# Altium schematic sheet 08.SchDoc
size 297 x 209 mm
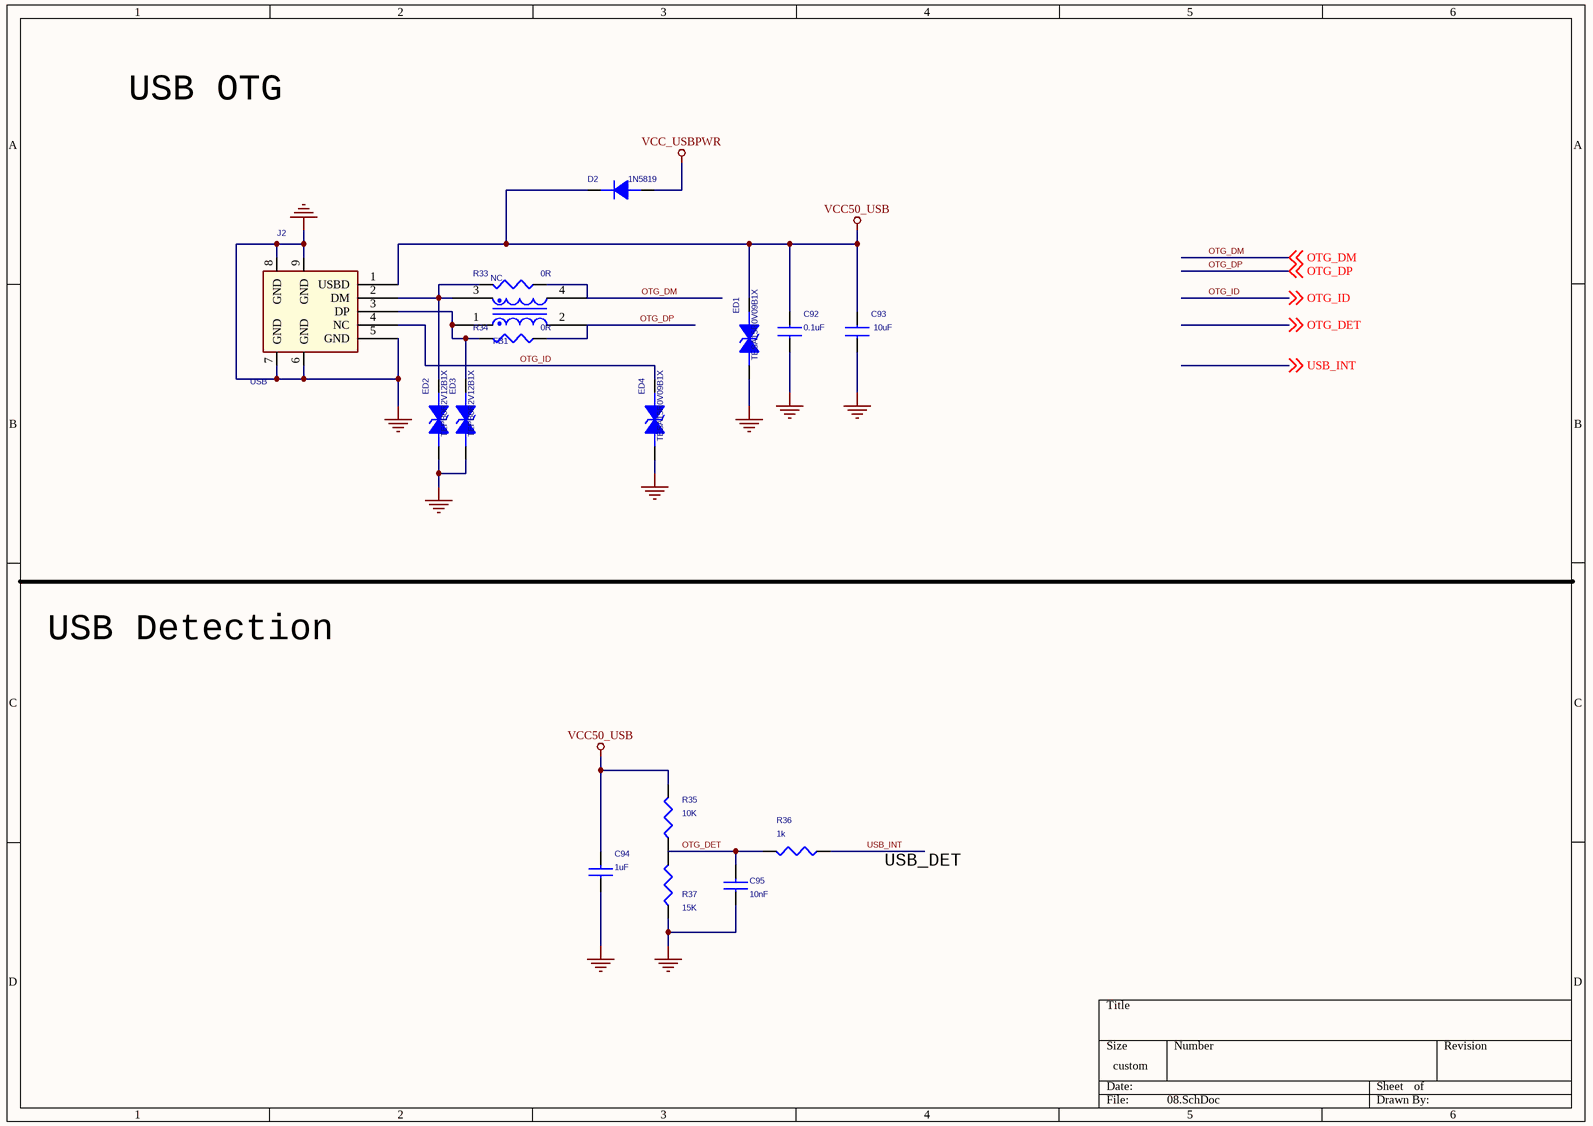
[diagram p0: 08.SchDoc]

## Parts
C92  0.1uF  [C0603]
C93  10uF  [C0603]
C94  1uF  [C0402]
C95  10nF  [C0402]
D2  1N5819  [SOD123]
ED1  TESA15R0V09B1X  [E0402N]
ED2  TEPB0R2V12B1X  [E0402N]
ED3  TEPB0R2V12B1X  [E0402N]
ED4  TESA15R0V09B1X  [E0402N]
FB1  NC  [LL-4]
J2  USB  [MICRO_USB_DIP]
R33  0R  [r0402]
R34  0R  [r0402]
R35  10K  [R0402]
R36  1k  [R0402]
R37  15K  [R0402]

## Nets
GND: C92.1 C93.2 C94.1 C95.1 ED1.2 ED2.2 ED3.2 ED4.2 J2.5(GND) J2.6(GND) J2.7(GND) J2.8(GND) J2.9(GND) R37.1
VCC50_USB: C92.2 C93.1 C94.2 D2.2(K) ED1.1 J2.1(USBD) R35.2
VCC_USBPWR: D2.1(A)
OTG_DET: C95.2 R35.1 R36.2 R37.2 ; off-sheet OTG_DET
OTG_DM: FB1.4 R33.1 ; off-sheet OTG_DM
OTG_DP: FB1.2 R34.1 ; off-sheet OTG_DP
OTG_ID: ED4.1 J2.4(NC) ; off-sheet OTG_ID
USB_INT: R36.1 ; off-sheet USB_INT
NetED2_1: ED2.1 FB1.3 J2.2(DM) R33.2
NetED3_1: ED3.1 FB1.1 J2.3(DP) R34.2

## Notes on the sheet
- USB OTG
- USB Detection
- USB_DET

## Library data of the parts
C92 = CAP NP_Dup3: 贴片电容; ROOM: USB+5V; MARK: 106
C93 = CAP NP_Dup3
C94 = CAP NP_Dup2: RoHS CHIP CAP 1uF +10/-10% X5R; MARK: 105
C95 = CAP NP_Dup2: RoHS CHIP CAP 10nF +10/-10% X7R
D2 = DIODE: Diode,Schottky,1N5819HW,40V,500mA,450mV; Supplier: DIODES; Supplier P/N: 1N5819HW
ED1-ED4 = TVS: ESD Component,5V,30P,SMD,0402
FB1 = L_CHOKE CM14: Chip common mode choke coil,90 ohm@100MHz,0.35 ohm/DCR,50V,330mA,-40°C~+ 85°C
J2 = MINI USB_0
R33 R34 = RESISTOR_0_Dup3: RES,thick film,10KOhm,+/-5%,1/16W,SMD0402
R35 R36 = RESISTOR_Dup1: ROHS CHIP RES 10K 1/16W 5%
R37 = RESISTOR_Dup1: ROHS CHIP RES 15K 1/16W 5%